# Altium schematic sheet Timer 555.SchDoc: =SchTitle
size 276 x 198 mm; Organization: ETML; Address1: Rue de Sébeillon12; Address2: CH - 1004 Lausanne; Address3: Tél. 021 316 77 77; Address4: www.etml.ch; SheetNumber: 3; SheetTotal: 4; Replace: .; ModA: .; ModB: .; ModC: .; ModD: .
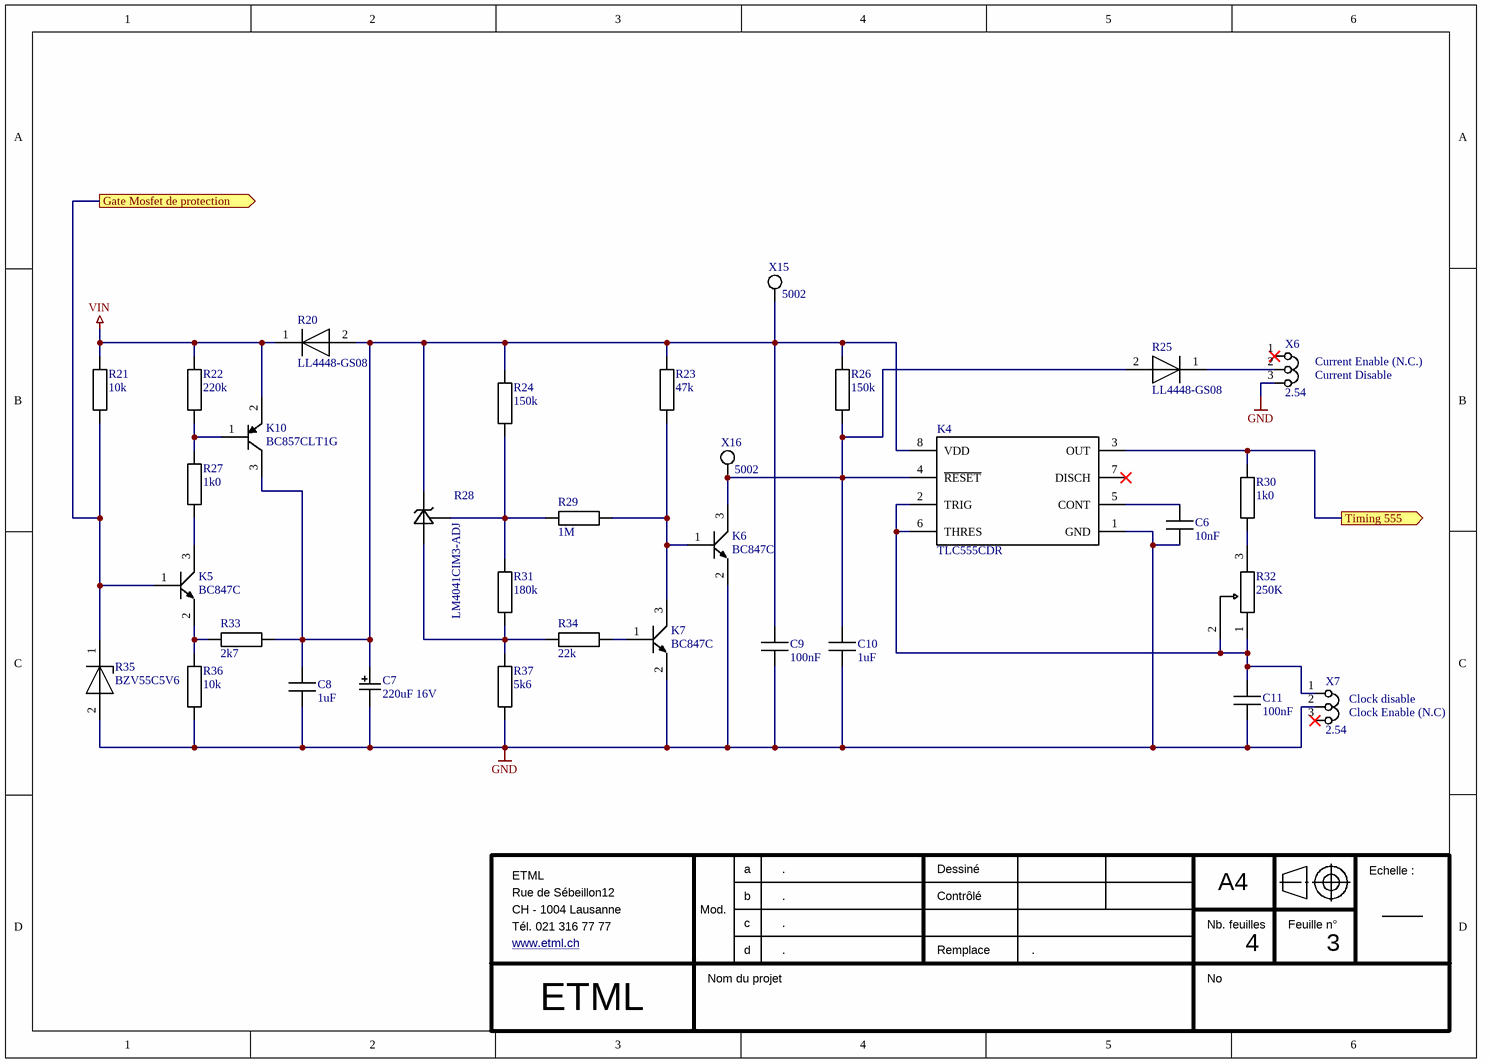
[diagram p0: Timer 555.SchDoc]

## Parts
C6  10nF  [CAPC1608X08M]
C7  220uF 16V  [NIC-CAPA2-6.3X7.7_V]
C8  1uF  [CAPC2012X08M]
C9  100nF  [CAPC2012X08M]
C10  1uF  [CAPC2012X08M]
C11  100nF  [CAPC2012X08M]
K4  TLC555CDR  [FP-D0008A-IPC_B]
K5  BC847C  [SOT90P240X110-3M]
K6  BC847C  [SOT90P240X110-3M]
K7  BC847C  [SOT90P240X110-3M]
K10  BC857CLT1G  [ONSC-SOT-23-3-318-08_V]
R20  LL4448-GS08  [FP-6_560-5005_01-4-MFG]
R21  10k  [RESC2012X06M]
R22  220k  [RESC2012X06M]
R23  47k  [RESC2012X06M]
R24  150k  [RESC2012X06M]
R25  LL4448-GS08  [FP-6_560-5005_01-4-MFG]
R26  150k  [RESC2012X06M]
R27  1k0  [RESC2012X06M]
R28  LM4041CIM3-ADJ  [DBZ0003A_M]
R29  1M  [RESC2012X06M]
R30  1k0  [RESC2012X06M]
R31  180k  [RESC2012X06M]
R32  250K  [FP-3296W-MFG]
R33  2k7  [RESC2012X06M]
R34  22k  [RESC2012X06M]
R35  BZV55C5V6  [FP-DO-213AA-MFG]
R36  10k  [RESC2012X06M]
R37  5k6  [RESC2012X06M]
X6  2.54  [PIN-1x03-2.54]
X7  2.54  [PIN-1x03-2.54]
X15  5002  [Keystone_5002]
X16  5002  [Keystone_5002]

## Ports
Gate Mosfet de protection (out), Timing 555 (out)

## Nets
GND: C6.1 C7.2 C8.1 C9.1 C10.1 C11.1 K4.1(GND) K6.2(Collector) K7.2(Collector) R35.2(A) R36.1 R37.1 X6.3 X7.2
VIN: K10.2(E) R20.1(C) R21.2 R22.2
Gate Mosfet de protection: K5.1(Base) R21.1 R35.1(C) ; port Gate Mosfet de protection
Timing 555: K4.3(OUT) R30.2 ; port Timing 555
NetC6_2: C6.2 K4.5(CONT)
NetC7_1: C7.1 C8.2 C9.2 K4.8(VDD) K10.3(C) R20.2(A) R23.2 R24.2 R26.2 R28.2(+V) R33.2 X15.1(TP)
NetC10_2: C10.2 K4.4(~{RESET}) K6.3(Emitter) R25.2(A) R26.1 X16.1(TP)
NetC11_2: C11.2 K4.2(TRIG) K4.6(THRES) R32.1(CCW) R32.2(WIPER) X7.1
NetK5_2: K5.2(Collector) R33.1 R36.2
NetK5_3: K5.3(Emitter) R27.1
NetK6_1: K6.1(Base) K7.3(Emitter) R23.1 R29.1
NetK7_1: K7.1(Base) R34.2
NetK10_1: K10.1(B) R22.1 R27.2
NetR24_1: R24.1 R28.1(FB) R29.2 R31.2
NetR25_1: R25.1(C) X6.2
NetR28_3: R28.3(-V) R31.1 R34.1 R37.2
NetR30_1: R30.1 R32.3(CW)

Not connected (* = marked no-connect by the designer): K4 7(DISCH)*; X6 1(0)*; X7 3*

## Notes on the sheet
- (near X6) Current Enable (N.C.)
- (near X6) Current Disable
- (near X7) Clock disable
- (near X7) Clock Enable (N.C)
- a
- Dessiné
- A4
- Echelle :
- Mod.
- b
- c
- d
- Contrôlé
- Remplace
- Nb. feuilles
- Feuille n°
- Nom du projet
- No

## Library data of the parts
C6 = CMP-065-000010-2: CAPC 10nF X7R 50V 10% 1608 (0603 INCH); Manufacturer: TDK; Manufacturer Number: C1608X7R1H103K080AA; TemperatureRange: -55°C to +125°C; IsStocked: 1; PN: PN-514948; Category: Passives; Voltage: 50V; Supplier 1: ETML; Supplier Part Number 1: FAB.0603_C 10nF; Tolerance: ±10%; SubCategory: Condensateurs ceramique; Dielectric: X7R; Supplier Price 1: 0.0123; Value: 10nF
C7 = CMP-0687-00060-1: Aluminum Electrolytic Capacitor,  220 uF, 16 V, + / - 20%,  6.3 x 7.7 mm D x L; PartNumber: UUD1C221MCL1GS; Manufacturer: Nichicon; Impedance: 0.34 Ohm; Tolerance Rated Capacitance: -20 to 20%; Endurance Time: 2000 h; Rated Ripple Current (at 100kHz): 280 mA; Packing: Dia382mm Reel; IsStocked: 1; PackageReference: CAPAE-D6.3H7.7; DatasheetVersion: 08/2012; Rated Voltage: 16 V; Rated Capacitance: 220 uF; ComponentLink1URL: http://www.nichicon.co.jp/; ComponentLink3URL: http://products.nichicon.co.jp/en/pdf/XJA043/e-ud.pdf; PackageDescription: 2-Pin Surface Mount Device, Diameter 6.3 mm, Height 7.7 mm, Pitch 5.4 mm; ComponentLink3Description: Package Specification; Length: 7.7 mm; RoHS: TRUE; Mounting Technology: Surface Mount; ComponentLink2Description: Datasheet; ComponentLink2URL: http://products.nichicon.co.jp/en/pdf/XJA043/e-ud.pdf; Diameter: 6.3 mm; ComponentLink1Description: Manufacturer URL; PN: UUD1C221MCL1GS; Supplier 1: Mouser; Supplier Part Number 1: 647-UUD1C221MCL; Supplier Price 1: 0.354
C8 C10 = CMP-065-000041-2: CAPC 1uF X5R 25V 10% 2012 (0805 INCH); Manufacturer: TDK; Manufacturer Number: KGM21AR51E105KU; Value: 1µF; TemperatureRange: -55°C to +85°C; IsStocked: 1; Supplier 1: Mouser; Category: Passives; Supplier Part Number 1: 581-KGM21AR51E105KU; SubCategory: Condensateurs ceramique; Tolerance: ±10%; Supplier Price 1: 1; Dielectric: X5R; Voltage: 25V; PN: KGM21AR51E105KU
C9 C11 = CMP-065-000038-2: CAPC 100nF X7R 50V 10% 2012 (0805 INCH); Manufacturer Number: C2012X7R1H104K085AA; Manufacturer: TDK; IsStocked: 1; TemperatureRange: -55°C to +125°C; PN: KAM21AR81H104KU; Supplier Part Number 1: 581-KAM21AR81H104KU; Supplier Price 1: 0.259; Voltage: 50V; Dielectric: X7R; Value: 100nF; SubCategory: Condensateurs ceramique; Category: Passives; Tolerance: ±10%; Supplier 1: Mouser
K4 = CMP-04857-000001-1: IC OSC SGL TIMER 2.1MHZ 8-SOIC; Min Supply Voltage: 2V; Number of Channels: 1; Max Power Dissipation: 725mW; Max Supply Voltage: 15V; Low Level Output Current: 100mA; Current Rating: 250A; Quiescent Current: 250uA; Operating Supply Current: 360uA; High Level Output Current: -10mA; Width: 3.91mm; Case/Package: SOIC; Weight: 0.002561oz; Frequency: 2.1MHz; Height: 1.58mm; Package Quantity: 2500; REACH SVHC: No SVHC; Number of Timers/Counters: 1; Lead Free: Lead Free; Number of Pins: 8; Max Operating Temperature: 125°C; Min Operating Temperature: -40°C; Length: 4.9mm; Radiation Hardening: No; Packaging: Tape and Reel; Termination: SMD/SMT; Mount: Surface Mount; Power Dissipation: 725mW; PN: TLC555CDR; Supplier 1: Mouser; Supplier Part Number 1: 595-TLC555CDR; Supplier Price 1: 0.553; IsStocked: 1
K5-K7 = BC847C: NPN general purpose transistor; IsStocked: 1; PN: BC847C; Supplier 1: Mouser; Supplier Part Number 1: 637-BC847C; Supplier Price 1: 0.086
K10 = CMP-1048-00802-1: General Purpose Transistor, PNP Silicon, 3-Pin SOT-23, Pb-Free, Tape and Reel, BC857CLT1G; Manufacturer: On Semiconductor; IC Continuous (A): -0.1; fT Min (MHz): 100; IsStocked: 1; Polarity: PNP; PackageReference: SOT-23-3-318-08; ComponentLink3Description: Package Specification; ComponentLink2Description: Datasheet; PackageDescription: 3-Pin Small Outline Transistor, Body 2.92 x 1.3 mm, Pitch 0.95 mm; PackageVersion: Rev. AP, 11/2009; ComponentLink1Description: Manufacturer URL; PartNumber: BC857CLT1G; ComponentLink2URL: http://www.onsemi.cn/pub_link/Collateral/BC856ALT1-D.PDF; ComponentLink1URL: http://www.onsemi.com/; ComponentLink3URL: http://www.onsemi.cn/pub_link/Collateral/318-08.PDF; RoHS: TRUE; Packing: Tape and Reel; Mounting Technology: Surface Mount; DatasheetVersion: Rev. 13; PN: BC857CLT1G; Supplier Part Number 1: 863-BC857CLT1G; Supplier 1: Mouser; Supplier Price 1: 0.086
R20 R25 = CMP-249167-000001-1: DIODE GEN PURP 75V 150MA SOD80; Manufacturer: Vishay Small Signal; Max Junction Temp: +175°C; Automotive Grade: Grade 0; Capacitance: 4pF; Peak Reverse Current: 5uA; Forward Current: 300mA; Max Repetitive Reverse Voltage: 100V; Max Surge Forward Current: 2A; Value: 4pF; IsStocked: 1; ComponentLink2Description: Datasheet; Height: 1.6mm; ComponentLink2URL: http://www.vishay.com/docs/85557/ll4148.pdf; Category: Diode; Lead Free: Yes; Device Class L3: Rectifier Diodes; Reverse Voltage: 75V; Mouser Description: Diodes - General Purpose, Power, Switching 100 Volt 100mA; RoHS: TRUE; Temperature: to +175°C; Automotive: Yes; Octopart: https://octopart.com/ll4448-gs08-vishay+small+signal-40886; Digikey Description: DIODE GEN PURP 75V 150MA SOD80; Manufacturer Part Number: LL4448-GS08; Temperature Range High: +175°C; Device Class L1: Discrete Semiconductors; Device Class L2: Diodes; Package: 6.560-5005.01-4; PN: LL4448-GS08; Supplier 1: Mouser; Supplier Part Number 1: 78-LL4448; Supplier Price 1: 0.139
R21 R36 = CMP-066-000199-2: RES 10kohm  ±1% 0.125W 2012 (0805 INCH); Manufacturer Number: RC0805FR-0710KL; Manufacturer: Yageo; PN: PN-374909; TemperatureCoeff: ±200ppm/°C; Voltage: 150V; TemperatureRange: -55°C to 155°C; IsStocked: 1; Tolerance: ±1%; Category: Passives; Value: 10k; Supplier Price 1: 0.0200; Supplier Part Number 1: FAB.0805_R 10k; Supplier 1: ETML; SubCategory: Resistances couche epaisse; Power: 0.125W
R22 = CMP-066-000215-2: RES 220kohm  ±1% 0.125W 2012 (0805 INCH); Manufacturer Number: RC0805FR-07220KL; Manufacturer: Yageo; PN: PN-479575; IsStocked: 1; TemperatureCoeff: ±200ppm/°C; Voltage: 150V; TemperatureRange: -55°C to 155°C; Value: 220k; Power: 0.125W; Tolerance: ±1%; Supplier Price 1: 0.0200; SubCategory: Resistances couche epaisse; Supplier 1: ETML; Category: Passives; Supplier Part Number 1: FAB.0805_R 220k
R23 = CMP-066-000207-2: RES 47kohm  ±1% 0.125W 2012 (0805 INCH); Manufacturer Number: RC0805FR-0747KL; Manufacturer: Yageo; TemperatureRange: -55°C to 155°C; Voltage: 150V; IsStocked: 1; TemperatureCoeff: ±200ppm/°C; PN: PN-427242; Category: Passives; Supplier Price 1: 0.0200; Power: 0.125W; Supplier 1: ETML; Tolerance: ±1%; SubCategory: Resistances couche epaisse; Supplier Part Number 1: FAB.0805_R 47k; Value: 47k
R24 R26 = CMP-066-000213-2: RES 150kohm  ±1% 0.125W 2012 (0805 INCH); Manufacturer: Yageo; Manufacturer Number: RC0805FR-07150KL; Voltage: 150V; TemperatureRange: -55°C to 155°C; TemperatureCoeff: ±200ppm/°C; PN: PN-241492; IsStocked: 1; Tolerance: ±1%; Supplier Part Number 1: FAB.0805_R 150k; Power: 0.125W; Value: 150k; Supplier Price 1: 0.0200; Category: Passives; Supplier 1: ETML; SubCategory: Resistances couche epaisse
R27 R30 = CMP-066-000187-2: RES 1.0kohm  ±1% 0.125W 2012 (0805 INCH); Manufacturer: Yageo; Manufacturer Number: RC0805FR-071KL; Value: 1k; PN: PN-746409; TemperatureRange: -55°C to 155°C; IsStocked: 1; TemperatureCoeff: ±200ppm/°C; Voltage: 150V; Supplier 1: ETML; SubCategory: Resistances couche epaisse; Supplier Price 1: 0.0200; Supplier Part Number 1: FAB.0805_R 1k0; Category: Passives; Tolerance: ±1%; Power: 0.125W
R28 = CMP-0074-00726-3: Precision Micropower Shunt Voltage Reference, 3-pin SOT-23; Manufacturer: Texas Instruments; PowerWise: N; PackageTopMarking: RAC*XTT; CompType: Voltage Reference IC; PN: LM4041CIM3-ADJ/NOPB; IsStocked: 1; DatasheetVersion: Mar-2005; PackageDescription: Molded SOT-23, .115 x .051 x .037in Body, 3 Lead, .075 in Pitch; PackageReference: DBZ0003A; PinCount: 3; PackageVersion: revB, Mar-2003; ComponentLink1URL: http://www.ti.com/general/docs/lit/getliterature.tsp?genericPartNumber=LM4041-N&fileType=pdf; RevisionNote: Component URLs added; RoHS: N; ComponentLink1Description: Datasheet URL; Supplier 1: Mouser; Supplier Part Number 1: 926-M4041CIM3ADJNOPB; Supplier Price 1: 0.623
R29 = CMP-066-000223-2: RES 1.0Mohm  ±1% 0.125W 2012 (0805 INCH); Manufacturer: Yageo; Manufacturer Number: RC0805FR-071ML; IsStocked: 1; Voltage: 150V; TemperatureCoeff: ±200ppm/°C; TemperatureRange: -55°C to 155°C; PN: PN-531908; Tolerance: ±1%; Supplier Price 1: 0.0200; Power: 0.125W; Supplier 1: ETML; Category: Passives; Supplier Part Number 1: FAB.0805_R 1M; SubCategory: Resistances couche epaisse; Value: 1M
R31 = CMP-066-000214-2: RES 180kohm  ±1% 0.125W 2012 (0805 INCH); Manufacturer: Yageo; Manufacturer Number: RC0805FR-07180KL; TemperatureCoeff: ±200ppm/°C; Voltage: 150V; TemperatureRange: -55°C to 155°C; PN: PN-810533; IsStocked: 1; SubCategory: Resistances couche epaisse; Power: 0.125W; Supplier 1: ETML; Value: 180k; Supplier Part Number 1: FAB.0805_R 180k; Tolerance: ±1%; Supplier Price 1: 0.0200; Category: Passives
R32 = CMP-07234-000001-1: TRIMMER 250K OHM 0.5W PC PIN TOP; Manufacturer: Bourns; Manufacturer Part Number: 3296W-1-254LF; Value: 250kΩ; Standoff Height: 0.38mm; Temperature Coefficient: 100ppm/°C; Tolerance: 10%; Voltage Rating: 300V; IsStocked: 1; Category: Res; Octopart: https://octopart.com/3296w-1-254lf-bourns-574856; Device Class L2: Resistors; Mouser Description: Res Cermet Trimmer 250K Ohm 10% 1/2W 25(Elec)Turn 2.19mm (9.53 X 4.83 X 11.55mm) Pin Thru-Hole Tube; Temperature: -55°C to +125°C; Temperature Range Low: -55°C; ComponentLink2URL: https://www.bourns.com/data/global/pdfs/3296.pdf; Power Rating: 0.5W; Package: 3296W; Lead Free: Yes; Series: Trimpot 3296-Sealed; Height: 12.05mm; Device Class L1: Passive Components; Device Class L3: Variable Resistors and Potentiometers; ComponentLink2Description: Datasheet; Resistance: 250kΩ; Digikey Description: TRIMMER 250K OHM 0.5W PC PIN TOP; Automotive: No; RoHS: TRUE; Temperature Range High: +125°C; PN: 3296W-1-254LF; Supplier 1: Mouser; Supplier Part Number 1: 652-3296W-1-254LF; Supplier Price 1: 2.12
R33 = CMP-066-000192-2: RES 2.7kohm  ±1% 0.125W 2012 (0805 INCH); Manufacturer Number: RC0805FR-072K7L; Manufacturer: Yageo; Value: 2.7k; TemperatureRange: -55°C to 155°C; TemperatureCoeff: ±200ppm/°C; IsStocked: 1; PN: PN-891617; Voltage: 150V; Category: Passives; Supplier 1: ETML; SubCategory: Resistances couche epaisse; Supplier Part Number 1: FAB.0805_R 2k7; Power: 0.125W; Tolerance: ±1%; Supplier Price 1: 0.0200
R34 = CMP-066-000203-2: RES 22kohm  ±1% 0.125W 2012 (0805 INCH); Manufacturer: Yageo; Manufacturer Number: RC0805FR-0722KL; PN: PN-851075; Voltage: 150V; TemperatureCoeff: ±200ppm/°C; TemperatureRange: -55°C to 155°C; IsStocked: 1; Tolerance: ±1%; Supplier Part Number 1: FAB.0805_R 22k; SubCategory: Resistances couche epaisse; Value: 22k; Supplier Price 1: 0.0200; Supplier 1: ETML; Category: Passives; Power: 0.125W
R35 = CMP-00252-16640727-1: BZV55C5V6 Diode Zener Single 5.6V 2% 3.33mW 2-Pin MELF DO-213AA Bag; Test Current: 5mA; Voltage Tolerance: 7%; Min Operating Temperature: -65°C; RoHS: Non-Compliant; Element Configuration: Single; Number of Pins: 2; NexarPartId: 16640727; Zener Voltage: 5.6V; Lifecycle Status: Production; Mount: Surface Mount; Tolerance: 7%; Max Operating Temperature: 175°C; PN: BZV55C5V6; Supplier 1: Mouser; Supplier Part Number 1: 494-BZV55C5V6; Supplier Price 1: 2.53
R37 = CMP-066-000196-2: RES 5.6kohm  ±1% 0.125W 2012 (0805 INCH); Manufacturer: Yageo; Manufacturer Number: RC0805FR-075K6L; IsStocked: 1; PN: PN-467784; TemperatureRange: -55°C to 155°C; Value: 5.6k; Voltage: 150V; TemperatureCoeff: ±200ppm/°C; Power: 0.125W; Supplier Part Number 1: FAB.0805_R 5k6; Tolerance: ±1%; Supplier Price 1: 0.0200; Supplier 1: ETML; Category: Passives; SubCategory: Resistances couche epaisse
X6 X7 = CMP-054-000017-1: JUMPER 2.54 1x03; Manufacturer Number: 61303611121; Manufacturer: Würth Electronik; Current: 3A; IsStocked: True; PN: PN-771444; Voltage: 250VAC; TemperatureRange: -40°C to +105 °C; Supplier 1: ETML; Supplier Price 1: 0.06; Category: Connectors; SubCategory: Jumpers; Supplier Part Number 1: MAG.283.897; Value: 2.54
X15 X16 = CMP-054-000004-1: TEST THT MINIATURE WT; Manufacturer: Keystone; PN: PN-357949; IsStocked: True; Category: Connectors; Value: 5002; Supplier Part Number 1: MAG.428.013; Supplier 1: ETML; Supplier Price 1: 0.2931; SubCategory: Testpoints; Manufacturer Number: 5002